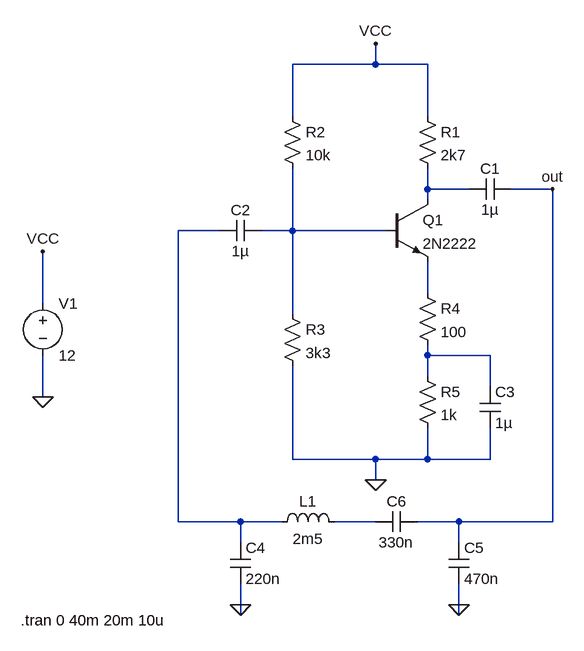
[diagram p0: schematic Perc-5-Clapp.asc]
Perc-5-Clapp.asc, the LTspice schematic file:
Version 4
SHEET 1 880 840
WIRE 208 -32 208 -64
WIRE 208 -32 80 -32
WIRE 288 -32 208 -32
WIRE 80 48 80 -32
WIRE 288 48 288 -32
WIRE 288 160 288 128
WIRE 352 160 288 160
WIRE 480 160 416 160
WIRE 288 176 288 160
WIRE -32 224 -96 224
WIRE 80 224 80 128
WIRE 80 224 32 224
WIRE 224 224 80 224
WIRE 288 320 288 272
WIRE -304 336 -304 256
WIRE 80 352 80 224
WIRE 288 416 288 400
WIRE 384 416 288 416
WIRE 288 448 288 416
WIRE 384 464 384 416
WIRE -304 480 -304 416
WIRE 80 576 80 432
WIRE 208 576 80 576
WIRE 288 576 288 528
WIRE 288 576 208 576
WIRE 384 576 384 528
WIRE 384 576 288 576
WIRE 208 608 208 576
WIRE -96 672 -96 224
WIRE 0 672 -96 672
WIRE 64 672 0 672
WIRE 208 672 144 672
WIRE 336 672 272 672
WIRE 480 672 480 160
WIRE 480 672 336 672
WIRE 0 704 0 672
WIRE 336 704 336 672
WIRE 0 800 0 768
WIRE 336 800 336 768
WIRE 0 816 0 800
WIRE 336 816 336 800
FLAG 208 608 0
FLAG 208 -64 VCC
FLAG -304 480 0
FLAG -304 256 VCC
FLAG 0 800 0
FLAG 336 800 0
FLAG 480 160 out
SYMBOL npn 224 176 R0
SYMATTR InstName Q1
SYMATTR Value 2N2222
SYMBOL res 272 32 R0
SYMATTR InstName R1
SYMATTR Value 2k7
SYMBOL res 64 32 R0
SYMATTR InstName R2
SYMATTR Value 10k
SYMBOL res 64 336 R0
SYMATTR InstName R3
SYMATTR Value 3k3
SYMBOL res 272 304 R0
SYMATTR InstName R4
SYMATTR Value 100
SYMBOL res 272 432 R0
SYMATTR InstName R5
SYMATTR Value 1k
SYMBOL cap 416 144 R90
WINDOW 0 0 32 VBottom 2
WINDOW 3 32 32 VTop 2
SYMATTR InstName C1
SYMATTR Value 1µ
SYMBOL cap 32 208 R90
WINDOW 0 0 32 VBottom 2
WINDOW 3 32 32 VTop 2
SYMATTR InstName C2
SYMATTR Value 1µ
SYMBOL cap 368 464 R0
SYMATTR InstName C3
SYMATTR Value 1µ
SYMBOL cap -16 704 R0
SYMATTR InstName C4
SYMATTR Value 220n
SYMBOL cap 320 704 R0
SYMATTR InstName C5
SYMATTR Value 470n
SYMBOL ind 48 688 R270
WINDOW 0 32 56 VTop 2
WINDOW 3 5 56 VBottom 2
SYMATTR InstName L1
SYMATTR Value 2m5
SYMBOL voltage -304 320 R0
SYMATTR InstName V1
SYMATTR Value 12
SYMBOL cap 272 656 R90
WINDOW 0 0 32 VBottom 2
WINDOW 3 32 32 VTop 2
SYMATTR InstName C6
SYMATTR Value 330n
TEXT -338 824 Left 2 !.tran 0 40m 20m 10u

The netlist it stands for:
* Perc-5-Clapp.asc
Q1 N001 N003 N004 0 2N2222
R1 VCC N001 2k7
R2 VCC N003 10k
R3 N003 0 3k3
R4 N004 N005 100
R5 N005 0 1k
C1 out N001 1µ
C2 N003 N002 1µ
C3 N005 0 1µ
C4 N002 0 220n
C5 out 0 470n
L1 N002 N006 2m5
V1 VCC 0 12
C6 out N006 330n
.model NPN NPN
.model PNP PNP
.lib standard.bjt
.tran 0 40m 20m 10u
.backanno
.end